# Altium schematic sheet Mainboard_LoRa   LoRa SCH.SchDoc
size A4
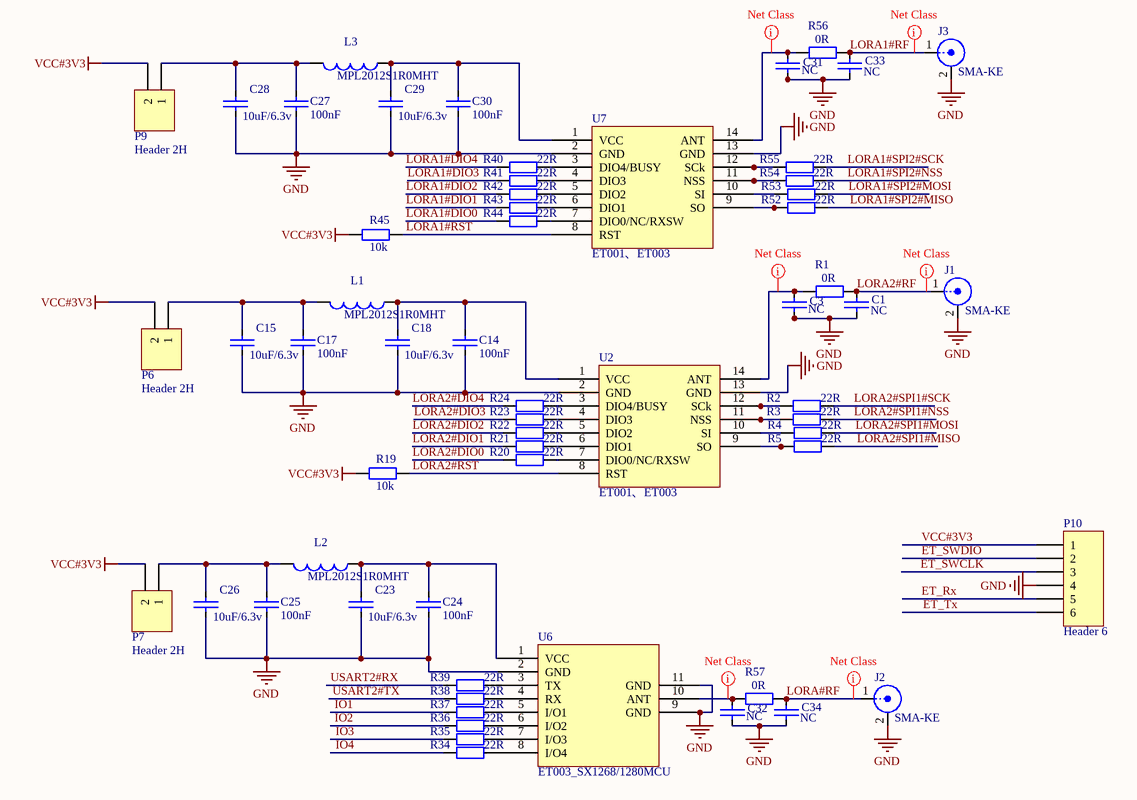
[diagram p0: Mainboard_LoRa   LoRa SCH.SchDoc]

## Parts
C1  NC  [CAPC_0603_2]
C3  NC  [CAPC_0603_2]
C14  100nF  [CAPC_0603_2]
C15  10uF/6.3v  [CAPC_0603_2]
C17  100nF  [CAPC_0603_2]
C18  10uF/6.3v  [CAPC_0603_2]
C23  10uF/6.3v  [CAPC_0603_2]
C24  100nF  [CAPC_0603_2]
C25  100nF  [CAPC_0603_2]
C26  10uF/6.3v  [CAPC_0603_2]
C27  100nF  [CAPC_0603_2]
C28  10uF/6.3v  [CAPC_0603_2]
C29  10uF/6.3v  [CAPC_0603_2]
C30  100nF  [CAPC_0603_2]
C31  NC  [CAPC_0603_2]
C32  NC  [CAPC_0603_2]
C33  NC  [CAPC_0603_2]
C34  NC  [CAPC_0603_2]
J1  SMA-KE  [SMARA]
J2  SMA-KE  [SMARA]
J3  SMA-KE  [SMARA]
L1  MPL2012S1R0MHT  [Inductor_0805]
L2  MPL2012S1R0MHT  [Inductor_0805]
L3  MPL2012S1R0MHT  [Inductor_0805]
P6  Header 2H  [Header 2.54X2]
P7  Header 2H  [Header 2.54X2]
P9  Header 2H  [Header 2.54X2]
P10  Header 6  [Header 2.54X6]
R1  0R  [RESC_0603_2]
R2  22R  [RESC_0603_2]
R3  22R  [RESC_0603_2]
R4  22R  [RESC_0603_2]
R5  22R  [RESC_0603_2]
R19  10k  [RESC_0603_2]
R20  22R  [RESC_0603_2]
R21  22R  [RESC_0603_2]
R22  22R  [RESC_0603_2]
R23  22R  [RESC_0603_2]
R24  22R  [RESC_0603_2]
R34  22R  [RESC_0603_2]
R35  22R  [RESC_0603_2]
R36  22R  [RESC_0603_2]
R37  22R  [RESC_0603_2]
R38  22R  [RESC_0603_2]
R39  22R  [RESC_0603_2]
R40  22R  [RESC_0603_2]
R41  22R  [RESC_0603_2]
R42  22R  [RESC_0603_2]
R43  22R  [RESC_0603_2]
R44  22R  [RESC_0603_2]
R45  10k  [RESC_0603_2]
R52  22R  [RESC_0603_2]
R53  22R  [RESC_0603_2]
R54  22R  [RESC_0603_2]
R55  22R  [RESC_0603_2]
R56  0R  [RESC_0603_2]
R57  0R  [RESC_0603_2]
U2  ET001、ET003  [ET001]
U6  ET003_SX1268/1280MCU  [ET001/3_MCU]
U7  ET001、ET003  [ET001]

## Nets
GND: C1.1 C3.1 C14.2 C15.1 C17.2 C18.1 C23.1 C24.2 C25.2 C26.1 C27.2 C28.1 C29.1 C30.2 C31.1 C32.1 C33.1 C34.1 J1.2(Y) J2.2(Y) J3.2(Y) P10.4 U2.2(GND) U2.13(GND) U6.2(GND) U6.9(GND) U6.11(GND) U7.2(GND) U7.13(GND)
VCC#3V3: P6.2 P7.2 P9.2 P10.1 R19.1 R45.1
ET_Rx: P10.5
ET_SWCLK: P10.3
ET_SWDIO: P10.2
ET_Tx: P10.6
IO1: R37.1
IO2: R36.1
IO3: R35.1
IO4: R34.1
LORA1#DIO0: R44.1
LORA1#DIO1: R43.1
LORA1#DIO2: R42.1
LORA1#DIO3: R41.1
LORA1#DIO4: R40.1
LORA1#RF: C33.2 J3.1(X) R56.2
LORA1#RST: R45.2 U7.8(RST)
LORA1#SPI2#MISO: R52.2
LORA1#SPI2#MOSI: R53.2
LORA1#SPI2#NSS: R54.2
LORA1#SPI2#SCK: R55.2
LORA2#DIO0: R20.1
LORA2#DIO1: R21.1
LORA2#DIO2: R22.1
LORA2#DIO3: R23.1
LORA2#DIO4: R24.1
LORA2#RF: C1.2 J1.1(X) R1.2
LORA2#RST: R19.2 U2.8(RST)
LORA2#SPI1#MISO: R5.2
LORA2#SPI1#MOSI: R4.2
LORA2#SPI1#NSS: R3.2
LORA2#SPI1#SCK: R2.2
LORA#RF: C34.2 J2.1(X) R57.2
USART2#RX: R39.1
USART2#TX: R38.1
NetC3_2: C3.2 R1.1 U2.14(ANT)
NetC14_1: C14.1 C18.2 L1.1 U2.1(VCC)
NetC15_2: C15.2 C17.1 L1.2 P6.1
NetC23_2: C23.2 C24.1 L2.1 U6.1(VCC)
NetC25_1: C25.1 C26.2 L2.2 P7.1
NetC27_1: C27.1 C28.2 L3.2 P9.1
NetC29_2: C29.2 C30.1 L3.1 U7.1(VCC)
NetC31_2: C31.2 R56.1 U7.14(ANT)
NetC32_2: C32.2 R57.1 U6.10(ANT)
NetR2_1: R2.1 U2.12(SCk)
NetR3_1: R3.1 U2.11(NSS)
NetR4_1: R4.1 U2.10(SI)
NetR5_1: R5.1 U2.9(SO)
NetR20_2: R20.2 U2.7(DIO0/NC/RXSW)
NetR21_2: R21.2 U2.6(DIO1)
NetR22_2: R22.2 U2.5(DIO2)
NetR23_2: R23.2 U2.4(DIO3)
NetR24_2: R24.2 U2.3(DIO4/BUSY)
NetR34_2: R34.2 U6.8(I/O4)
NetR35_2: R35.2 U6.7(I/O3)
NetR36_2: R36.2 U6.6(I/O2)
NetR37_2: R37.2 U6.5(I/O1)
NetR38_2: R38.2 U6.4(RX)
NetR39_2: R39.2 U6.3(TX)
NetR40_2: R40.2 U7.3(DIO4/BUSY)
NetR41_2: R41.2 U7.4(DIO3)
NetR42_2: R42.2 U7.5(DIO2)
NetR43_2: R43.2 U7.6(DIO1)
NetR44_2: R44.2 U7.7(DIO0/NC/RXSW)
NetR52_1: R52.1 U7.9(SO)
NetR53_1: R53.1 U7.10(SI)
NetR54_1: R54.1 U7.11(NSS)
NetR55_1: R55.1 U7.12(SCk)

## Layout directives
net class RF: LORA1#RF, LORA2#RF, LORA#RF, NetC3_2, NetC31_2, NetC32_2

## Notes on the sheet
- 产品名称：
- 图纸编号：
- Size:
- Rev:
- Date:
- Sheet:

## Library data of the parts
C1 C3 C14 C15 C17 C18 C23-C34 = C: 无极性电容
J1-J3 = SMB: SMB Straight Connector; LatestRevisionDate: 17-Jul-2002; LatestRevisionNote: Re-released for DXP Platform.; Publisher: Altium Limited
L1-L3 = Inductor: Inductor  footprint4026; Code_IEC: 1005; Published: 8-Jun-2000; LatestRevisionDate: 17-Jul-2002; LatestRevisionNote: Re-released for DXP Platform.; PackageReference: 0402-A; Publisher: Altium Limited; Code_JEITA: 0402
P6 P7 P9 = Header 2H: Header, 2-Pin, Right Angle; LatestRevisionDate: 17-Jul-2002; LatestRevisionNote: Re-released for DXP Platform.; Publisher: Altium Limited
P10 = Header 6: Header, 6-Pin; LatestRevisionDate: 17-Jul-2002; LatestRevisionNote: Re-released for DXP Platform.; Publisher: Altium Limited
R1-R5 R19-R24 R34-R45 R52-R57 = R: Resistor
  R2-R5 R19-R24 R34-R45 R52-R55: Published: 8-Jun-2000; LatestRevisionDate: 17-Jul-2002; LatestRevisionNote: Re-released for DXP Platform.; PackageReference: AXIAL-0.4; Publisher: Altium Limited; PackageDescription: Axial Device, Thru-Hole; 2 Leads; 0.4 in Pin Spacing
U2 U7 = SX_1278/1268/1280
U6 = ET001/3_MCU